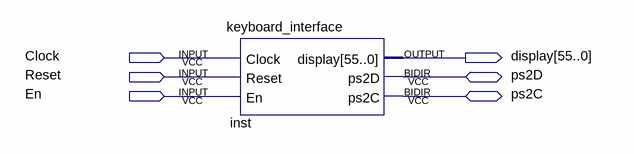
[diagram p0: schematic sheet]
// Quartus schematic keyboard.bdf as structural Verilog: 1 symbols, 6 pins
module keyboard (
  input  Clock,
  input  Reset,
  input  En,
  inout  ps2D,
  inout  ps2C,
  output [55:0] display
);

  keyboard_interface inst (.Clock(Clock), .Reset(Reset), .En(En), .display(display), .ps2D(ps2D), .ps2C(ps2C));
endmodule
